# EAGLE design ai_breakout_ws2812b (EAGLE 6.5.0)
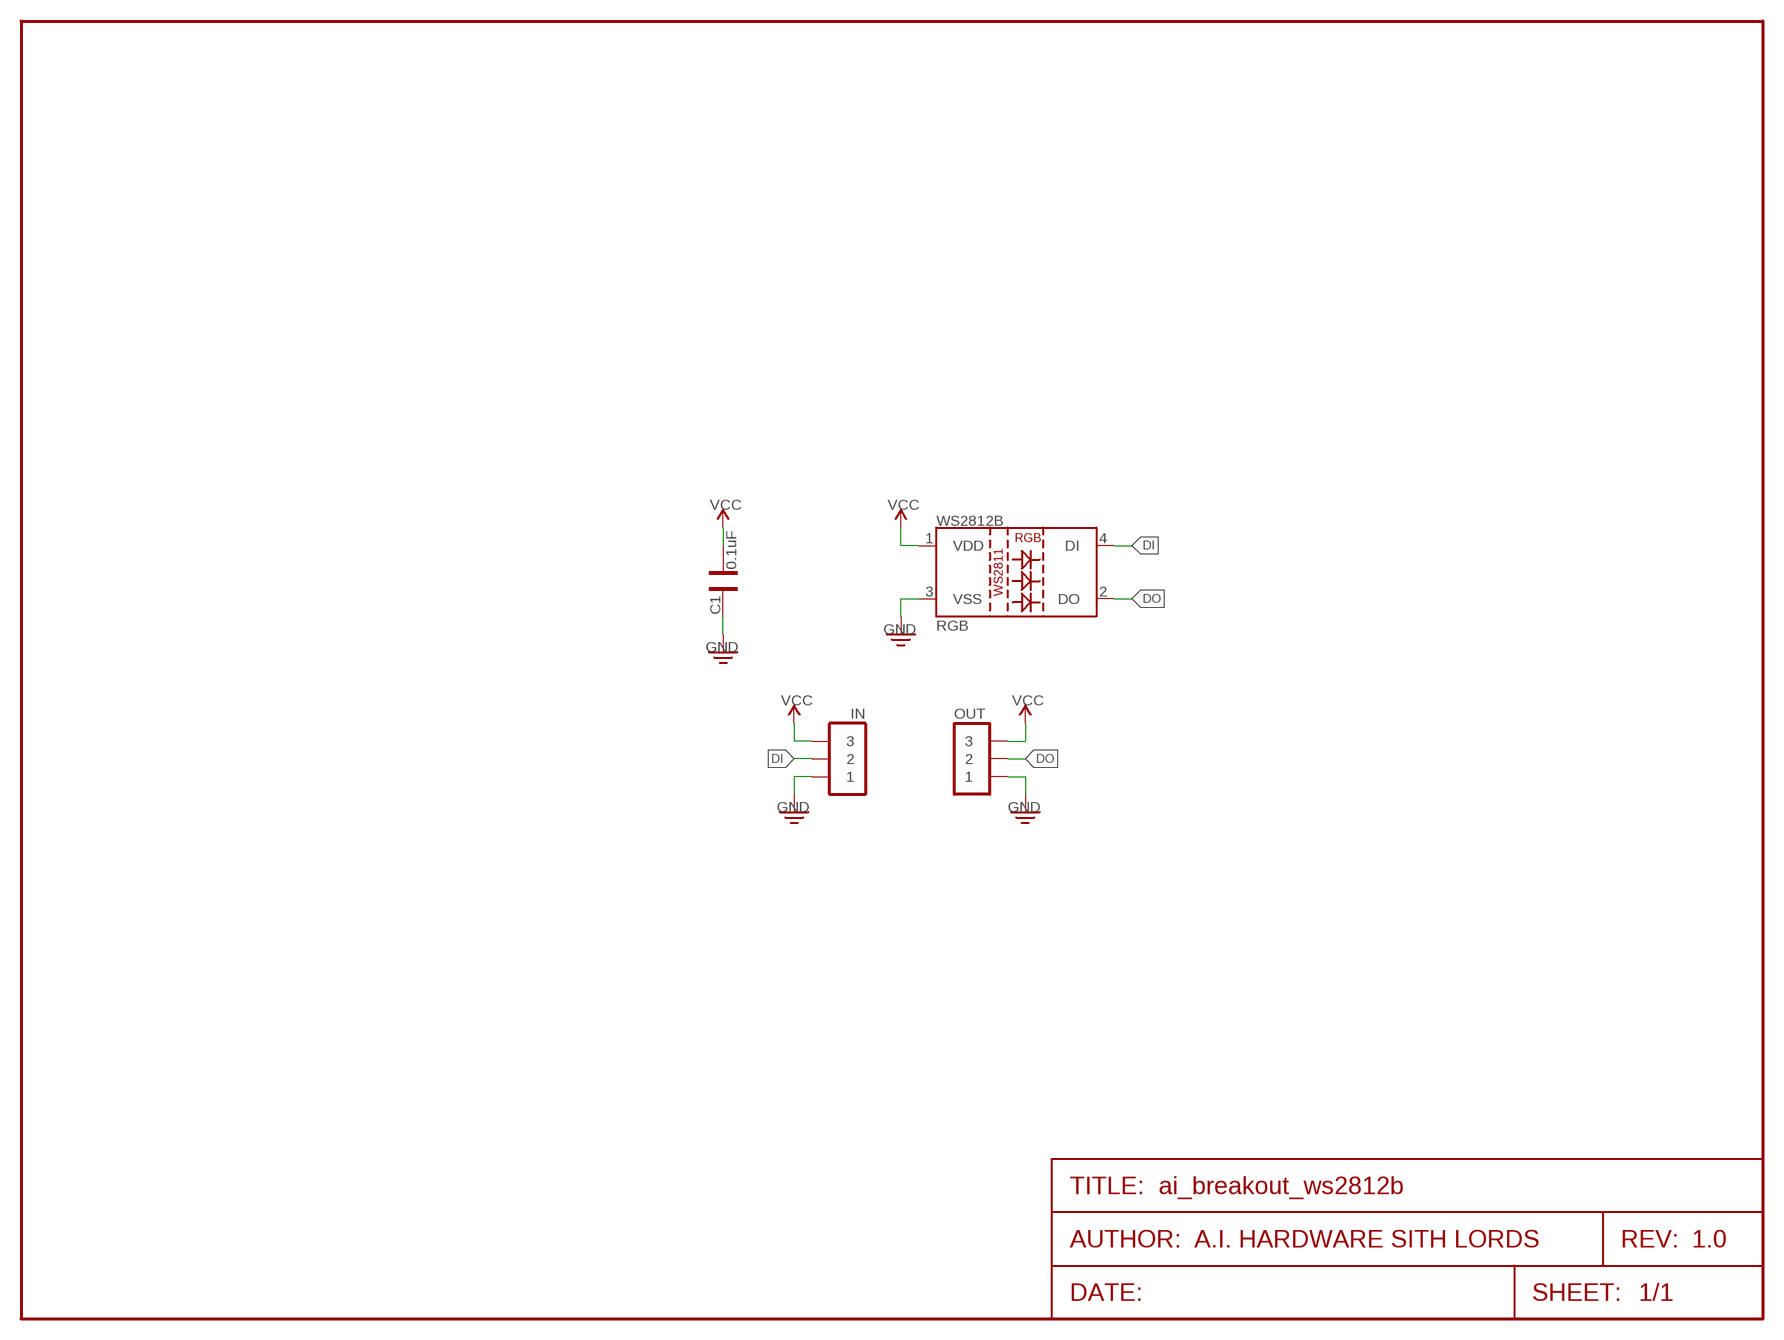
[diagram p0: schematic, sheet 1]
FRAME1 (FRAME-LETTER): AUTHOR: A.I. HARDWARE SITH LORDS; REV: 1.0

## Parts
C1  0.1uF  CAP0402  [CAP-0402]
IN  1X03  [1X03]
OUT  1X03NOFIRST  [1X03-NOFIRST]
RGB  LED-WS2812B-SM  [LED-WS2812B-SM]

## Nets
DI: IN.2 RGB.4(DI)
DO: OUT.2 RGB.2(DO)
GND: C1.2 IN.1 OUT.1 RGB.3(VSS)
VCC: C1.1 IN.3 OUT.3 RGB.1(VDD)

## Library data of the parts
C1 = Ai_Passives:CAP
IN OUT = Ai_Connectors:1X03
RGB = Ai_LED:LED-WS2812B

## Board
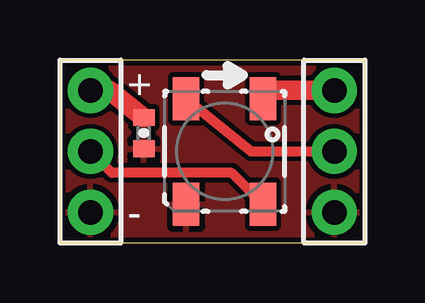
[diagram p1: board, top side]
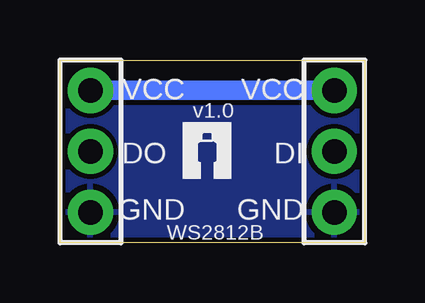
[diagram p2: board, bottom side, seen from below]

Size 12.7 x 7.62 mm. Coordinates in mm from the lower left corner, seen from the top.
Outline: 0,0 12.7,0 12.7,7.62 0,7.62 0,0
Copper layers (1*16): Top 0.035mm / dielectric 1.5mm / Bottom 0.035mm
Design rules "ai_2layer": minimum track width 7mil, minimum drill 15mil, track to track 8mil, track to pad 8mil, pad to pad 8mil, via to via 8mil, smd to smd 8mil, copper to edge 8mil, drill to drill 8mil, minimum pad ring 12mil, minimum via ring 10mil, stop-mask expansion 4mil, vias tented up to drill 20mil, thermal gap 10mil

### Footprints (pad centres in the part's own frame; a part is rotated, then mirrored left to right if it is on the bottom)
CAP-0402 = smd 0.7 x 0.9: 1 -0.65,0; 2 0.65,0
1X03 = drill 1.016 pad 1.88: 1 -2.54,0; 2 0,0; 3 2.54,0
1X03-NOFIRST = drill 1.016 pad 1.88: 1 -2.54,0; 2 0,0; 3 2.54,0
LED-WS2812B-SM = smd 1.8 x 1.1: 1 -2.2,1.6; 2 -2.2,-1.6; 3 2.2,-1.6; 4 2.2,1.6

### Placement (x,y rotation side)
C1  3.49,4.57 270 top
IN  1.27,3.81 90 top
OUT  11.43,3.81 90 top
RGB  6.86,3.81 270 top
U$5  [AI-LOGO-XS]  7.56,2.67 0 bottom

### Tracks (layer width: path | path; a pad name or v marks a point on that pad's centre or on a via)
DI
  Top 0.406: RGB.4 7.15,2.92 2.16,2.92 IN.2
DO
  Top 0.406: RGB.2 7.97,3.81 OUT.2
GND
  pour Top: 0,7.62 12.7,7.62 12.7,0 0,0
  pour Bottom: 0,7.62 12.7,7.62 12.7,0 0,0
VCC
  Top 0.813: RGB.1 8.8,6.35 OUT.3 | C1.1 2.04,6.35 IN.3
  Bottom 0.813: OUT.3 IN.3

### Text on the board
tPlace: + | -
bPlace: VCC | VCC | v1.0 | DI | DO | GND | GND | WS2812B